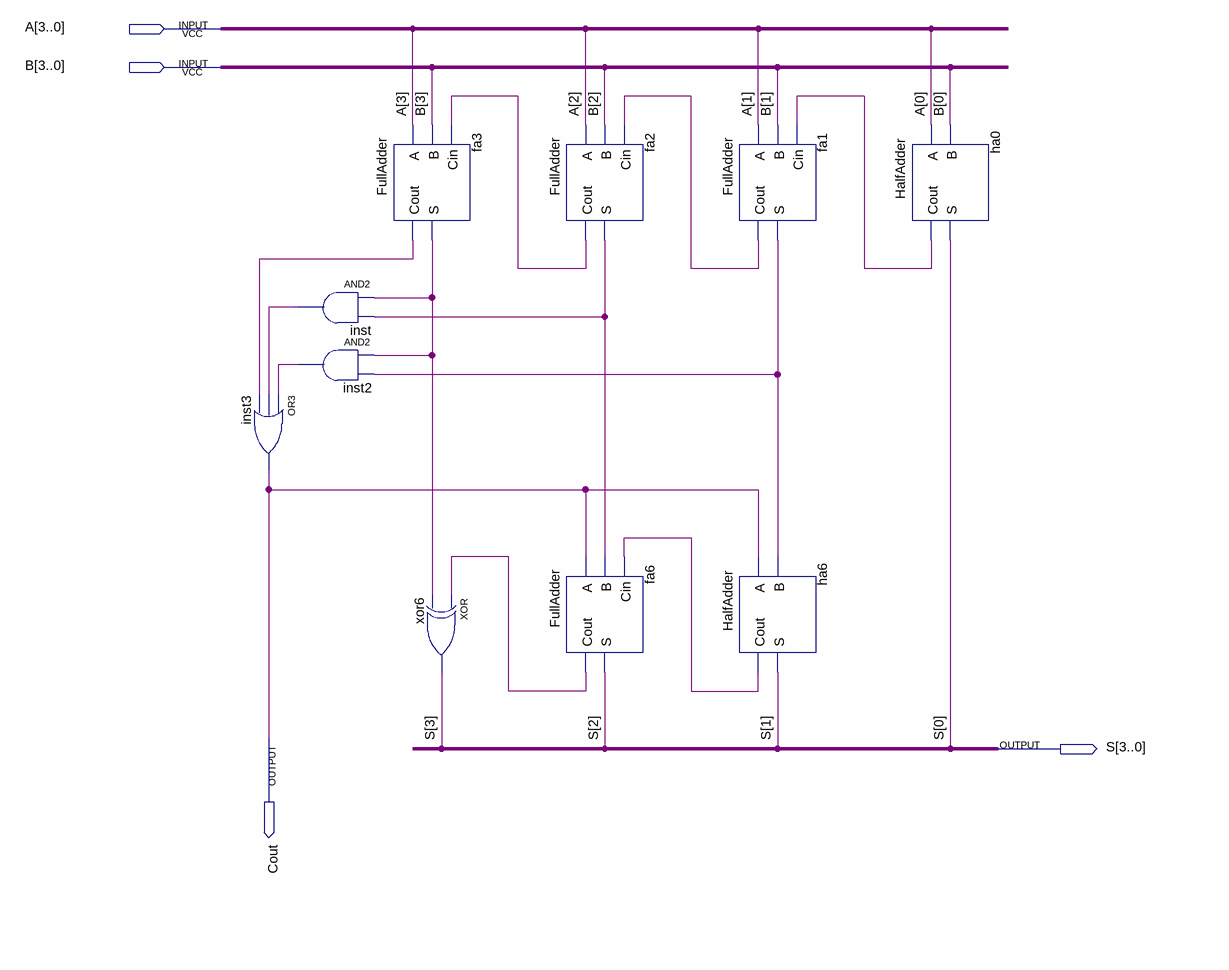
[diagram p0: schematic sheet]
// Quartus schematic SBCD.bdf as structural Verilog: 10 symbols, 4 pins
module SBCD (
  input  [3:0] A,
  input  [3:0] B,
  output Cout,
  output [3:0] S
);

  wire fa1_cout, fa1_s, fa2_cout, fa2_s, fa3_cout, fa3_s, fa6_cout, ha0_cout, ha6_cout, inst2_out, inst_out;

  or inst3 (Cout, inst2_out, inst_out, fa3_cout);
  and inst (inst_out, fa3_s, fa2_s);
  and inst2 (inst2_out, fa3_s, fa1_s);
  FullAdder fa3 (.A(A[3]), .B(B[3]), .Cin(fa2_cout), .S(fa3_s), .Cout(fa3_cout));
  xor xor6 (S[3], fa6_cout, fa3_s);
  FullAdder fa2 (.A(A[2]), .B(B[2]), .Cin(fa1_cout), .S(fa2_s), .Cout(fa2_cout));
  FullAdder fa6 (.A(Cout), .B(fa2_s), .Cin(ha6_cout), .S(S[2]), .Cout(fa6_cout));
  FullAdder fa1 (.A(A[1]), .B(B[1]), .Cin(ha0_cout), .S(fa1_s), .Cout(fa1_cout));
  HalfAdder ha6 (.A(Cout), .B(fa1_s), .S(S[1]), .Cout(ha6_cout));
  HalfAdder ha0 (.A(A[0]), .B(B[0]), .S(S[0]), .Cout(ha0_cout));
endmodule
